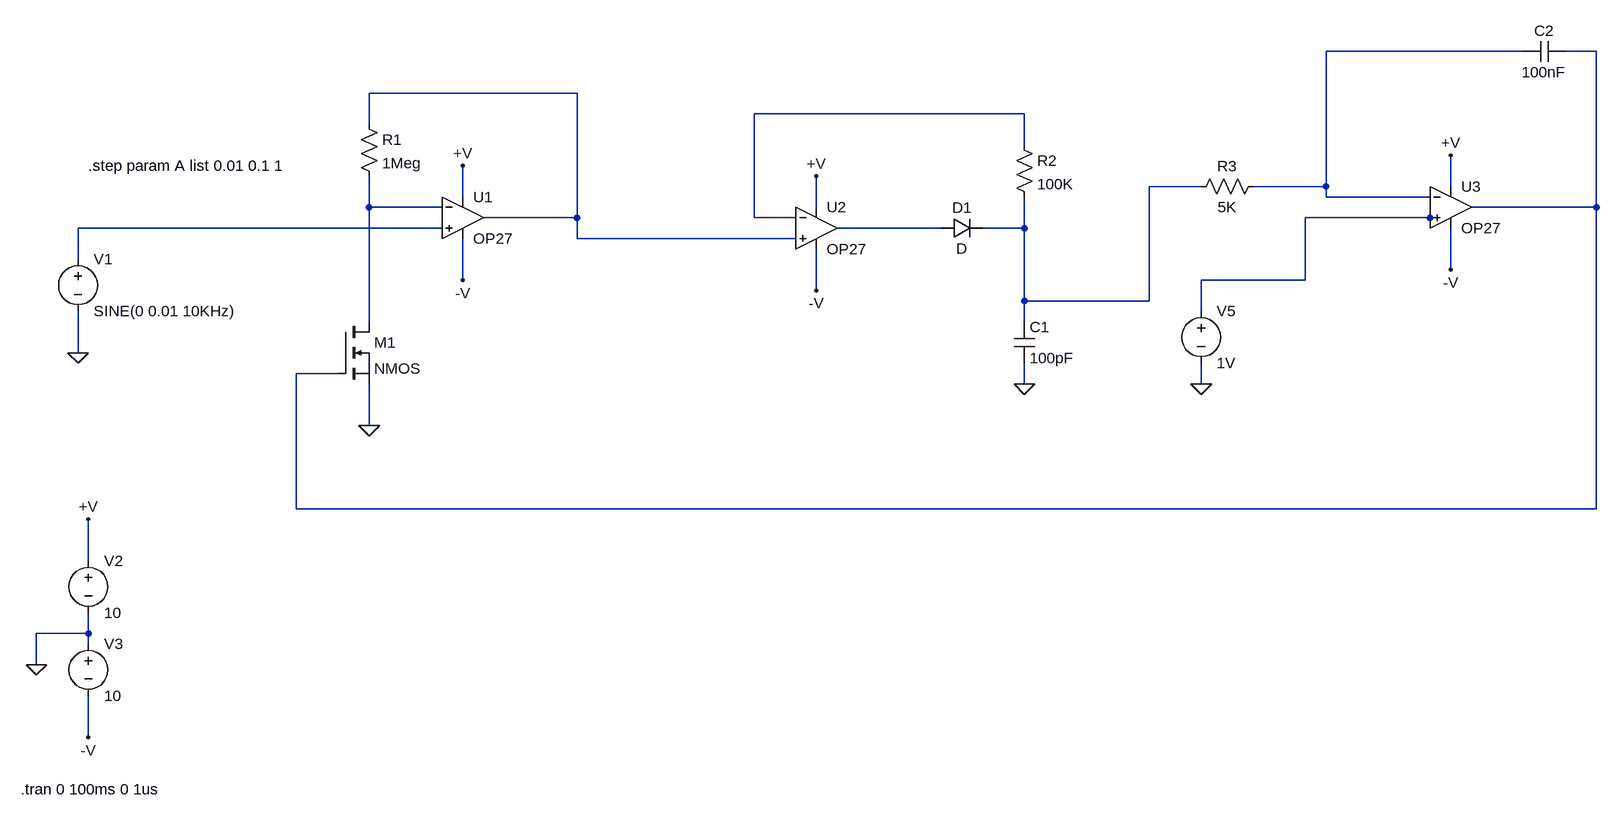
[diagram p0: schematic agc.asc]
agc.asc, the LTspice schematic file:
Version 4
SHEET 1 1512 816
WIRE 1280 -336 976 -336
WIRE 1392 -336 1344 -336
WIRE -176 -272 -496 -272
WIRE 512 -240 96 -240
WIRE -496 -224 -496 -272
WIRE 512 -192 512 -240
WIRE 784 -128 704 -128
WIRE 976 -128 976 -336
WIRE 976 -128 864 -128
WIRE 1168 -128 1168 -176
WIRE -352 -112 -352 -160
WIRE 976 -112 976 -128
WIRE 1136 -112 976 -112
WIRE -496 -96 -496 -144
WIRE -384 -96 -496 -96
WIRE 192 -96 192 -144
WIRE 1392 -96 1392 -336
WIRE 1392 -96 1200 -96
WIRE -176 -80 -176 -272
WIRE -176 -80 -320 -80
WIRE 96 -80 96 -240
WIRE 160 -80 96 -80
WIRE 1136 -80 944 -80
WIRE 1152 -80 1136 -80
WIRE -384 -64 -944 -64
WIRE 384 -64 224 -64
WIRE 512 -64 512 -112
WIRE 512 -64 448 -64
WIRE -176 -48 -176 -80
WIRE 160 -48 -176 -48
WIRE -944 -16 -944 -64
WIRE 1168 0 1168 -64
WIRE -352 16 -352 -48
WIRE 944 16 944 -80
WIRE 944 16 784 16
WIRE 192 32 192 -32
WIRE 512 48 512 -64
WIRE 704 48 704 -128
WIRE 704 48 512 48
WIRE 784 64 784 16
WIRE -496 80 -496 -96
WIRE 512 80 512 48
WIRE -944 128 -944 64
WIRE -544 160 -608 160
WIRE 512 176 512 144
WIRE 784 176 784 144
WIRE -496 240 -496 176
WIRE -608 368 -608 160
WIRE 1392 368 1392 -96
WIRE 1392 368 -608 368
WIRE -928 448 -928 384
WIRE -928 560 -928 528
WIRE -928 560 -1008 560
WIRE -928 576 -928 560
WIRE -1008 608 -1008 560
WIRE -928 720 -928 656
FLAG -496 240 0
FLAG -944 128 0
FLAG -1008 608 0
FLAG -352 -160 +V
FLAG -928 384 +V
FLAG -352 16 -V
FLAG -928 720 -V
FLAG 192 -144 +V
FLAG 192 32 -V
FLAG 512 176 0
FLAG 1168 -176 +V
FLAG 1168 0 -V
FLAG 784 176 0
SYMBOL Opamps\\OP27 -352 -144 R0
SYMATTR InstName U1
SYMBOL res -512 -240 R0
SYMATTR InstName R1
SYMATTR Value 1Meg
SYMBOL nmos -544 80 R0
SYMATTR InstName M1
SYMBOL voltage -944 -32 R0
WINDOW 123 0 0 Left 2
WINDOW 39 0 0 Left 2
SYMATTR InstName V1
SYMATTR Value SINE(0 0.01 10KHz)
SYMBOL voltage -928 432 R0
WINDOW 123 0 0 Left 2
WINDOW 39 0 0 Left 2
SYMATTR InstName V2
SYMATTR Value 10
SYMBOL voltage -928 560 R0
WINDOW 123 0 0 Left 2
WINDOW 39 0 0 Left 2
SYMATTR InstName V3
SYMATTR Value 10
SYMBOL Opamps\\OP27 192 -128 R0
SYMATTR InstName U2
SYMBOL diode 384 -48 R270
WINDOW 0 32 32 VTop 2
WINDOW 3 0 32 VBottom 2
SYMATTR InstName D1
SYMBOL cap 496 80 R0
SYMATTR InstName C1
SYMATTR Value 100pF
SYMBOL Opamps\\OP27 1168 -160 R0
SYMATTR InstName U3
SYMBOL voltage 784 48 R0
WINDOW 123 0 0 Left 2
WINDOW 39 0 0 Left 2
SYMATTR InstName V5
SYMATTR Value 1V
SYMBOL cap 1344 -352 R90
WINDOW 0 0 32 VBottom 2
WINDOW 3 32 32 VTop 2
SYMATTR InstName C2
SYMATTR Value 100nF
SYMBOL res 496 -208 R0
SYMATTR InstName R2
SYMATTR Value 100K
SYMBOL res 880 -144 R90
WINDOW 0 0 56 VBottom 2
WINDOW 3 32 56 VTop 2
SYMATTR InstName R3
SYMATTR Value 5K
TEXT -1032 800 Left 2 !.tran 0 100ms 0 1us
TEXT -928 -160 Left 2 !.step param A list 0.01 0.1 1

The netlist it stands for:
* agc.asc
XU1 N008 N006 +V -V N003 OP27  ; pins In+ In- V+ V- OUT
R1 N003 N006 1Meg
M1 N006 N002 0 0 NMOS
V1 N008 0 SINE(0 0.01 10KHz)
V2 +V 0 10
V3 0 -V 10
XU2 N003 N004 +V -V N009 OP27  ; pins In+ In- V+ V- OUT
D1 N009 N005 D
C1 N005 0 100pF
XU3 N007 N001 +V -V N002 OP27  ; pins In+ In- V+ V- OUT
V5 N007 0 1V
C2 N002 N001 100nF
R2 N004 N005 100K
R3 N001 N005 5K
.model D D
.lib standard.dio
.model NMOS NMOS
.model PMOS PMOS
.lib standard.mos
.tran 0 100ms 0 1us
.step param A list 0.01 0.1 1
.lib ADI.lib
.backanno
.end